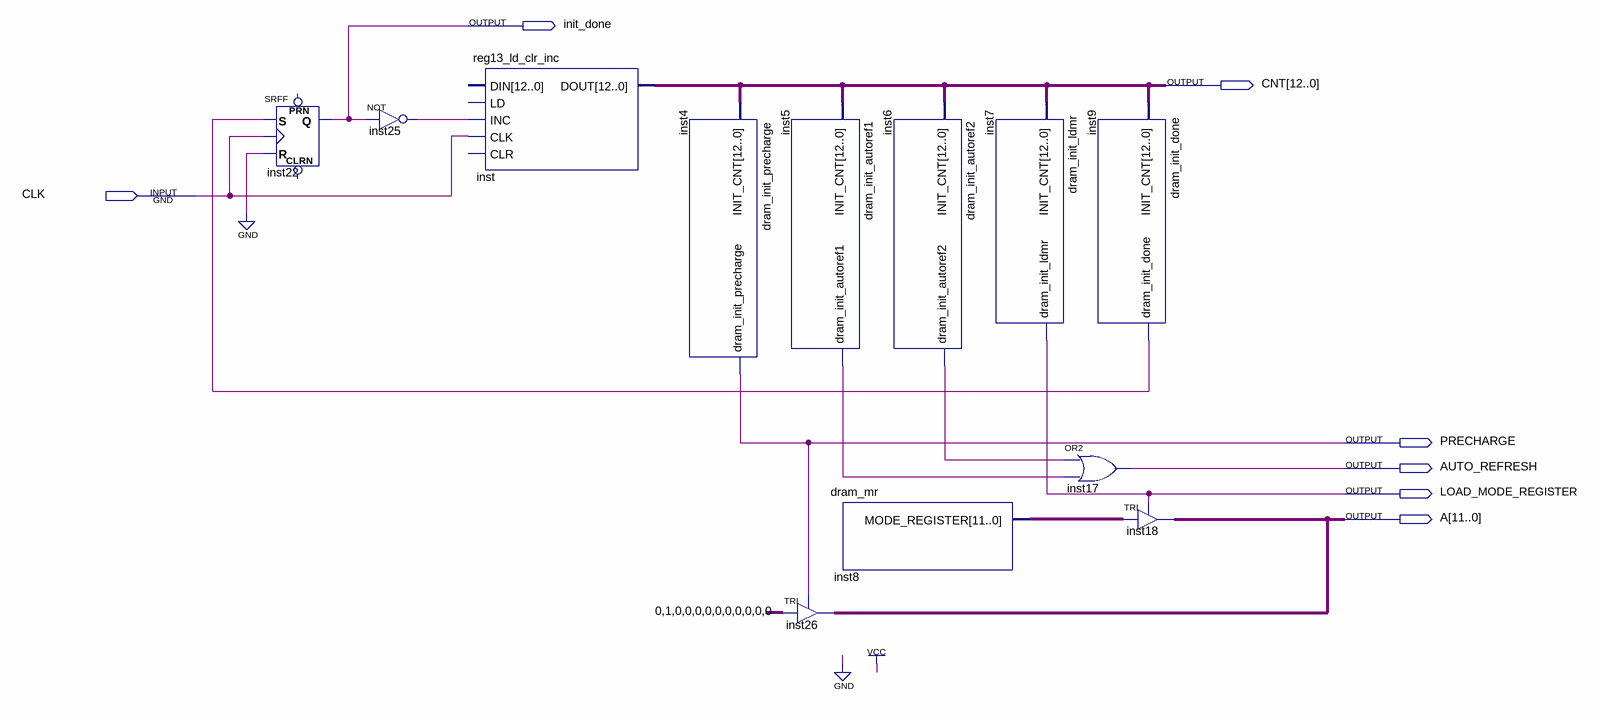
[diagram p0: schematic sheet]
// Quartus schematic dram_init.bdf as structural Verilog: 12 symbols, 7 pins
module dram_init (
  input  CLK,
  output init_done,
  output [12:0] CNT,
  output PRECHARGE,
  output AUTO_REFRESH,
  output LOAD_MODE_REGISTER,
  output [11:0] A
);

  wire inst5_dram_init_autoref1, inst6_dram_init_autoref2, inst9_dram_init_done, inst25_out;
  wire [11:0] inst8_mode_register;

  SRFF inst22 (.S(inst9_dram_init_done), .R(1'b0), .CLK(CLK), .Q(init_done));  // open: PRN, CLRN
  not inst25 (inst25_out, init_done);
  reg13_ld_clr_inc inst (.INC(inst25_out), .CLK(CLK), .DOUT(CNT));  // open: DIN, LD, CLR
  dram_init_precharge inst4 (.INIT_CNT(CNT), .dram_init_precharge(PRECHARGE));
  dram_init_autoref1 inst5 (.INIT_CNT(CNT), .dram_init_autoref1(inst5_dram_init_autoref1));
  TRI inst26[11:0] (.IN(12'b010000000000), .OE(PRECHARGE), .OUT(A));
  dram_mr inst8 (.MODE_REGISTER(inst8_mode_register));
  dram_init_autoref2 inst6 (.INIT_CNT(CNT), .dram_init_autoref2(inst6_dram_init_autoref2));
  dram_init_ldmr inst7 (.INIT_CNT(CNT), .dram_init_ldmr(LOAD_MODE_REGISTER));
  dram_init_done inst9 (.INIT_CNT(CNT), .dram_init_done(inst9_dram_init_done));
  or inst17 (AUTO_REFRESH, inst6_dram_init_autoref2, inst5_dram_init_autoref1);
  TRI inst18[11:0] (.IN(inst8_mode_register), .OE(LOAD_MODE_REGISTER), .OUT(A));
endmodule
